# EAGLE design motobit (EAGLE 7.7.0)
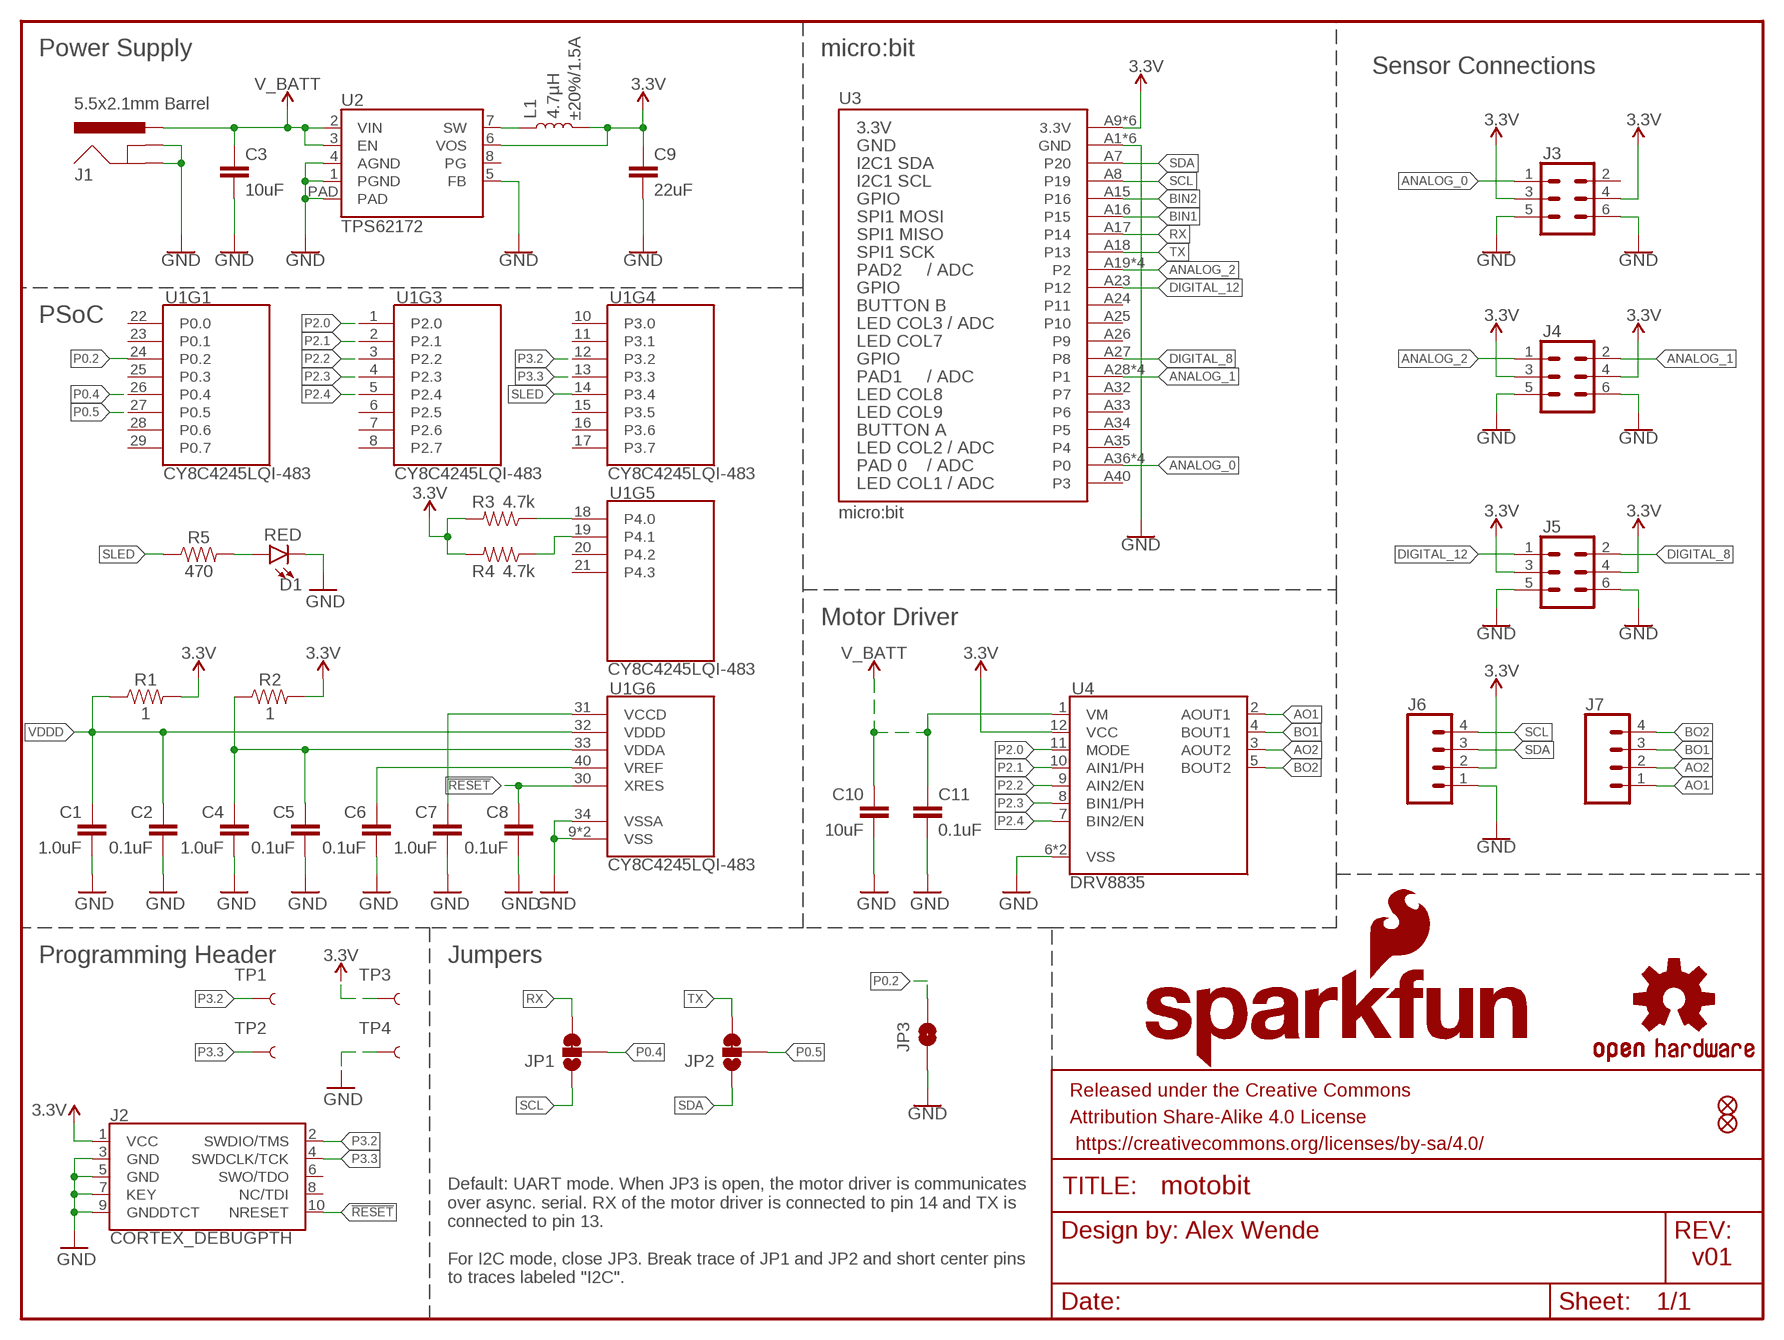
[diagram p0: schematic, sheet 1]

## Parts
C1  1.0uF  1.0UF-0603-16V-10%  [0603]
C2  0.1uF  0.1UF-0603-25V-(+80/-20%)  [0603]
C3  10uF  10UF-1210-50V-20%  [1210]
C4  1.0uF  1.0UF-0603-16V-10%  [0603]
C5  0.1uF  0.1UF-0603-25V-(+80/-20%)  [0603]
C6  0.1uF  0.1UF-0603-25V-(+80/-20%)  [0603]
C7  1.0uF  1.0UF-0603-16V-10%  [0603]
C8  0.1uF  0.1UF-0603-25V-(+80/-20%)  [0603]
C9  22uF  22UF-0805-6.3V-20%  [0805]
C10  10uF  10UF-1210-50V-20%  [1210]
C11  0.1uF  0.1UF-0603-25V-(+80/-20%)  [0603]
D1  RED  LED-RED0603  [LED-0603]
FD1  FIDUCIALUFIDUCIAL  [FIDUCIAL-MICRO]
FD2  FIDUCIALUFIDUCIAL  [FIDUCIAL-MICRO]
FRAME1  FRAME-LETTER  [CREATIVE_COMMONS]
J1  5.5x2.1mm Barrel  POWER_JACKSMD  [POWER_JACK_SMD]
J2  CORTEX_DEBUGPTH  [2X5-PTH-1.27MM]
J3  CONN_03X2FEMALE_SMD  [2X3_SMD]
J4  CONN_03X2FEMALE_SMD  [2X3_SMD]
J5  CONN_03X2FEMALE_SMD  [2X3_SMD]
J6  CONN_04SMD_STRAIGHT_COMBO  [1X04_SMD_VERTICAL_COMBO]
J7  CONN_04SMD_RA_FEMALE  [1X04_SMD_RA_FEMALE]
JP1  JUMPER-SMT_3_1-NC_TRACE_SILK  [SMT-JUMPER_3_1-NC_TRACE_SILK]
JP2  JUMPER-SMT_3_1-NC_TRACE_SILK  [SMT-JUMPER_3_1-NC_TRACE_SILK]
JP3  JUMPER-SMT_2_NO_SILK  [SMT-JUMPER_2_NO_SILK]
L1  4.7µH  INDUCTOR-VLF4012AT-2.2UH  [INDUCTOR_2.2UH]
LOGO1  SFE_LOGO_NAME_FLAME.2_INCH  [SFE_LOGO_NAME_FLAME_.2]
LOGO2  OSHW-LOGOM  [OSHW-LOGO-M]
R1  1  1OHM-0603-1/10W-1%  [0603]
R2  1  1OHM-0603-1/10W-1%  [0603]
R3  4.7k  4.7KOHM-0603-1/10W-1%  [0603]
R4  4.7k  4.7KOHM-0603-1/10W-1%  [0603]
R5  470  470OHM-0603-1/10W-1%  [0603]
TP1  TEST-POINT3  [PAD.03X.03]
TP2  TEST-POINT3  [PAD.03X.03]
TP3  TEST-POINT3  [PAD.03X.03]
TP4  TEST-POINT3  [PAD.03X.03]
U1  CY8C4245LQI-483  PSOC4_4200_40QFN  [QFN-40]
U2  TPS62172  [WSON-8-PAD]
U3  micro:bit  MICRO:BITLEDS_UP  [MICRO:BIT_RA_PTH]
U4  DRV8835  DRV883X  [WSON-12]

## Nets
3.3V: C9.1 J2.1(VCC) J3.3 J3.4 J4.3 J4.4 J5.3 J5.4 J6.2 L1.P$2 R1.2 R2.2 R3.2 R4.2 TP3.P$1 U2.6(VOS) U3.A9(3.3V) U3.A10(3.3V) U3.A11(3.3V) U3.A12(3.3V) U3.A13(3.3V) U3.A14(3.3V) U4.12(VCC)
!RESET: C8.1 J2.10(NRESET) U1.30(XRES)
ANALOG_0: J3.1 U3.A36(P0) U3.A37(P0) U3.A38(P0) U3.A39(P0)
ANALOG_1: J4.2 U3.A28(P1) U3.A29(P1) U3.A30(P1) U3.A31(P1)
ANALOG_2: J4.1 U3.A19(P2) U3.A20(P2) U3.A21(P2) U3.A22(P2)
AO1: J7.1 U4.2(AOUT1)
AO2: J7.2 U4.3(AOUT2)
BIN1: U3.A16(P15)
BIN2: U3.A15(P16)
BO1: J7.3 U4.4(BOUT1)
BO2: J7.4 U4.5(BOUT2)
DIGITAL_8: J5.2 U3.A27(P8)
DIGITAL_12: J5.1 U3.A23(P12)
GND: C1.2 C2.2 C3.2 C4.2 C5.2 C6.2 C7.2 C8.2 C9.2 C10.2 C11.2 D1.C J1.GND(GNDBREAK) J1.P$4(GND) J2.3(GND) J2.5(GND) J2.7(KEY) J2.9(GNDDTCT) J3.5 J3.6 J4.5 J4.6 J5.5 J5.6 J6.1 JP3.1 TP4.P$1 U1.9(VSS) U1.34(VSSA) U1.EP(VSS) U2.1(PGND) U2.4(AGND) U2.5(FB) U2.PAD U3.A1(GND) U3.A2(GND) U3.A3(GND) U3.A4(GND) U3.A5(GND) U3.A6(GND) U4.6(VSS) U4.PAD(VSS)
N$1: C7.1 U1.31(VCCD)
N$2: C6.1 U1.40(VREF)
N$3: C4.1 C5.1 R2.1 U1.33(VDDA)
N$4: L1.P$1 U2.7(SW)
N$6: R3.1 U1.18(P4.0)
N$7: R4.1 U1.19(P4.1)
N$8: D1.A R5.2
P0.2: JP3.2 U1.24(P0.2)
P0.4: JP1.2 U1.26(P0.4)
P0.5: JP2.2 U1.27(P0.5)
P2.0: U1.1(P2.0) U4.11(MODE)
P2.1: U1.2(P2.1) U4.10(AIN1/PH)
P2.2: U1.3(P2.2) U4.9(AIN2/EN)
P2.3: U1.4(P2.3) U4.8(BIN1/PH)
P2.4: U1.5(P2.4) U4.7(BIN2/EN)
P3.2: J2.2(SWDIO/TMS) TP1.P$1 U1.12(P3.2)
P3.3: J2.4(SWDCLK/TCK) TP2.P$1 U1.13(P3.3)
RX: JP1.3 U3.A17(P14)
SCL: J6.4 JP1.1 U3.A8(P19)
SDA: J6.3 JP2.1 U3.A7(P20)
SLED: R5.1 U1.14(P3.4)
TX: JP2.3 U3.A18(P13)
V_BATT: C3.1 C10.1 C11.1 J1.VIN0(PWR) U2.2(VIN) U2.3(EN) U4.1(VM)
VDDD: C1.1 C2.1 R1.1 U1.32(VDDD)
Unconnected: J2.6(SWO/TDO) J2.8(NC/TDI) J3.2 U1.6(P2.5) U1.7(P2.6) U1.8(P2.7) U1.10(P3.0) U1.11(P3.1) U1.15(P3.5) U1.16(P3.6) U1.17(P3.7) U1.20(P4.2) U1.21(P4.3) U1.22(P0.0) U1.23(P0.1) U1.25(P0.3) U1.28(P0.6) U1.29(P0.7) U1.35(P1.0) U1.36(P1.1) U1.37(P1.2) U1.38(P1.3) U1.39(P1.4) U2.8(PG) U3.A24(P11) U3.A25(P10) U3.A26(P9) U3.A32(P7) U3.A33(P6) U3.A34(P5) U3.A35(P4) U3.A40(P3)

## Notes on the sheet
- Power Supply | micro:bit
- Sensor Connections
- ±20%/1.5A
- PSoC
- Motor Driver
- Programming Header | Jumpers
- Alex Wende
- v01
- Default: UART mode. When JP3 is open, the motor driver is communicates
  over async. serial. RX of the motor driver is connected to pin 14 and TX is 
  connected to pin 13. 
  
  For I2C mode, close JP3. Break trace of JP1 and JP2 and short center pins
  to traces labeled "I2C".

## Library data of the parts
C1 C4 C7 = SparkFun-Capacitors:1.0UF: 1µF ceramic capacitors A capacitor is a passive two-terminal electrical component used to store electrical energy temporarily in an electric field.; PROD_ID: CAP-00868
C2 C5 C6 C8 C11 = SparkFun-Capacitors:0.1UF: 0.1µF ceramic capacitors A capacitor is a passive two-terminal electrical component used to store electrical energy temporarily in an electric field.; PROD_ID: CAP-00810
C3 C10 = SparkFun-Capacitors:10UF: 10.0µF ceramic capacitors A capacitor is a passive two-terminal electrical component used to store electrical energy temporarily in an electric field.; PROD_ID: CAP-09824
C9 = SparkFun-Capacitors:22UF: 22µF ceramic capacitors A capacitor is a passive two-terminal electrical component used to store electrical energy temporarily in an electric field.; PROD_ID: CAP-08402
D1 = SparkFun-LED:LED-RED: Red SMD LED Used in manufacturing of most products at SparkFun Packages: 0603 - SMD 0603 package [Product Link] <http://docs.avagotech.com/docs/AV02-0551EN> 0603 SMART - SMD 0603 SMART package ( more efficient and expensive)[Product Link] <http://www.osram-os.com/Graphics/XPic2/00077099_0.pdf> 1206 - SMD1206 package [Product Link] <https://www.sparkfun.com/datasheets/DevTools/LilyPad/Q150OVS4.pdff> SparkFun Products: Pro Mini 328 -5V <https://www.sparkfun.com/products/821> RedBoard <https://www.sparkfun.com/products/12757> IOIO-OTG <https://www.sparkfun.com/products/13613>; PROD_ID: DIO-00819
FD1 FD2 = SparkFun-Aesthetics:FIDUCIAL: Fiducial Alignment Points Point-of-reference for pick-and-place machines and other optical instruments.
FRAME1 = SparkFun-Aesthetics:FRAME-LETTER: Schematic Frame - Letter Standard 8.5x11 US Letter frame
J1 = SparkFun-Connectors:POWER_JACK: Power Jack Connector This is the standard 5.5mm barrel jack for power. The PTH is the most common, proven, reliable, footprint. The Slot footprint only works if the mill layer is transmitted to the PCB fab house so be warned. Here are the connectors we sell at SparkFun: DC Barrel Power Jack/Connector <https://www.sparkfun.com/products/119> (PRT-00119) DC Barrel Power Jack/Connector (SMD) <https://www.sparkfun.com/products/12748> (PRT-12748) DC Barrel Jack Adapter - Breadboard Compatible <https://www.sparkfun.com/products/10811> (PRT-10811) It is used on this SparkFun product (and many, many others): SparkFun RedBoard - Programmed with Arduino <https://www.sparkfun.com/products/12757> (DEV-12757) Also, if you need a mating power supply or connector, please check these out: Wall Adapter Power Supply - 9VDC 650mA <https://www.sparkfun.com/products/298> (TOL-00298) DC Barrel Jack Adapter - Male <https://www.sparkfun.com/products/10287> (PRT-10287); PROD_ID: CONN-08106; SF_ID: PRT-12748
J2 = Pete_Connectors_Retired:CORTEX_DEBUG: Cortex Debug Connector Datasheet <http://infocenter.arm.com/help/topic/com.arm.doc.faqs/attached/13634/cortex_debug_connectors.pdf>
J3-J5 = SparkFun-Connectors:CONN_03X2: Multi connection point. Often used as Generic Header-pin footprint for 0.1 inch spaced/style header connections You can populate with any combo of single row headers, but if you'd like an exact match, check these: Header - 2x3 (Male, 0.1") <https://www.sparkfun.com/products/12807> (PRT-12807) Header - 2x3 (Female, 0.1") <https://www.sparkfun.com/products/13010> (PRT-13010) 2x3 Pin Shrouded Header <https://www.sparkfun.com/products/10877> (PRT-10877) On any of the 0.1 inch spaced packages, you can populate with these: Break Away Headers - Straight <https://www.sparkfun.com/products/116> (PRT-00116) Break Away Male Headers - Right Angle <https://www.sparkfun.com/products/553> (PRT-00553) Female Headers <https://www.sparkfun.com/products/115> (PRT-00115) Break Away Headers - Machine Pin <https://www.sparkfun.com/products/117> (PRT-00117) Break Away Female Headers - Swiss Machine Pin <https://www.sparkfun.com/products/743> (PRT-00743) Special note: the shrouded connector mates well with our 3x2 ribbon cables: Ribbon Crimp Connector - 6-pin (2x3, Female) <https://www.sparkfun.com/products/10651> (PRT-10651) Ribbon Cable - 6 wire (15ft) <https://www.sparkfun.com/products/10646> (PRT-10646); PROD_ID: CONN-11290
J6 = SparkFun-Connectors:CONN_04: Multi connection point. Often used as Generic Header-pin footprint for 0.1 inch spaced/style header connections On any of the 0.1 inch spaced packages, you can populate with these: Break Away Headers - Straight <https://www.sparkfun.com/products/116> (PRT-00116) Break Away Male Headers - Right Angle <https://www.sparkfun.com/products/553> (PRT-00553) Female Headers <https://www.sparkfun.com/products/115> (PRT-00115) Break Away Headers - Machine Pin <https://www.sparkfun.com/products/117> (PRT-00117) Break Away Female Headers - Swiss Machine Pin <https://www.sparkfun.com/products/743> (PRT-00743) For SCREWTERMINALS and SPRING TERMINALS visit here: Screw Terimnals on SparkFun.com <https://www.sparkfun.com/search/results?term=Screw+Terminals> (5mm/3.5mm/2.54mm spacing) This device is also useful as a general connection point to wire up your design to another part of your project. Our various solder wires solder well into these plated through hole pads. Hook-Up Wire - Assortment (Stranded, 22 AWG) <https://www.sparkfun.com/products/11375> (PRT-11375) Hook-Up Wire - Assortment (Solid Core, 22 AWG) <https://www.sparkfun.com/products/11367> (PRT-11367) View the entire wire category on our website here <https://www.sparkfun.com/categories/141> Special notes: Molex polarized connector foot print use with SKU : PRT-08231 with associated crimp pins and housings. 1MM SMD Version SKU: PRT-10208; PROD_ID: CONN-08511; VALUE: 1X04_SMD_STRAIGHT_COMBO
J7 = SparkFun-Connectors:CONN_04: Multi connection point. Often used as Generic Header-pin footprint for 0.1 inch spaced/style header connections On any of the 0.1 inch spaced packages, you can populate with these: Break Away Headers - Straight <https://www.sparkfun.com/products/116> (PRT-00116) Break Away Male Headers - Right Angle <https://www.sparkfun.com/products/553> (PRT-00553) Female Headers <https://www.sparkfun.com/products/115> (PRT-00115) Break Away Headers - Machine Pin <https://www.sparkfun.com/products/117> (PRT-00117) Break Away Female Headers - Swiss Machine Pin <https://www.sparkfun.com/products/743> (PRT-00743) For SCREWTERMINALS and SPRING TERMINALS visit here: Screw Terimnals on SparkFun.com <https://www.sparkfun.com/search/results?term=Screw+Terminals> (5mm/3.5mm/2.54mm spacing) This device is also useful as a general connection point to wire up your design to another part of your project. Our various solder wires solder well into these plated through hole pads. Hook-Up Wire - Assortment (Stranded, 22 AWG) <https://www.sparkfun.com/products/11375> (PRT-11375) Hook-Up Wire - Assortment (Solid Core, 22 AWG) <https://www.sparkfun.com/products/11367> (PRT-11367) View the entire wire category on our website here <https://www.sparkfun.com/categories/141> Special notes: Molex polarized connector foot print use with SKU : PRT-08231 with associated crimp pins and housings. 1MM SMD Version SKU: PRT-10208
JP1 JP2 = SparkFun-Jumpers:JUMPER-SMT_3_1-NC_TRACE: Normally closed trace jumper (1 of 2 connections) This jumper has a trace between two pads so it's normally closed (NC). The other connection is normally open (NO). Use a razor knife to open the connection. For best results follow the IPC guidelines for cutting traces: Cutout at least 0.063 mm (0.005 in). Remove all loose material to clean up the cut area. Seal the cut with an approved epoxy. Reapply solder to reclose the connection, or to close the NO connection.
JP3 = SparkFun-Jumpers:JUMPER-SMT_2_NO: Normally open jumper This jumper has two pads in close proximity to each other. Apply solder to close the connection. Round pads are easier to solder for beginners, but are a lot larger. SparkFun Product that uses the round pads: SparkFun EL Sequencer <https://www.sparkfun.com/products/12781>
L1 = SparkFun-Coils:INDUCTOR: Inductors Resist changes in electrical current. Basically a coil of wire. SparkFun Products: SparkFun Load Cell Amplifier - HX711 <https://www.sparkfun.com/products/13879> IOIO-OTG - V2.2 <https://www.sparkfun.com/products/13613>; PROD_ID: NDUC-09513; VALUE: 4.7µH/±20%/1.5A
LOGO1 = SparkFun-Aesthetics:SFE_LOGO_NAME_FLAME: SparkFun Font Logo w/ Flame This is the SparkFun full logo. The logo on the schematic will always be the same size; the package variant is the height of the flame part of the logo. Default layer for the logo on the board is tSilk.
LOGO2 = SparkFun-Aesthetics:OSHW-LOGO: Open-Source Hardware (OSHW) Logo This logo indicates the piece of hardware it is found on incorporates a OSHW license and/or adheres to the definition of open source hardware found here: http://freedomdefined.org/OSHW
R1 R2 = SparkFun-Resistors:1OHM: 1Ω resistor A resistor is a passive two-terminal electrical component that implements electrical resistance as a circuit element. Resistors act to reduce current flow, and, at the same time, act to lower voltage levels within circuits. - Wikipedia; PROD_ID: RES-08269
R3 R4 = SparkFun-Resistors:4.7KOHM: 4.7kΩ resistor A resistor is a passive two-terminal electrical component that implements electrical resistance as a circuit element. Resistors act to reduce current flow, and, at the same time, act to lower voltage levels within circuits. - Wikipedia; PROD_ID: RES-07857
R5 = SparkFun-Resistors:470OHM: 470Ω resistor A resistor is a passive two-terminal electrical component that implements electrical resistance as a circuit element. Resistors act to reduce current flow, and, at the same time, act to lower voltage levels within circuits. - Wikipedia; PROD_ID: RES-07869
TP1-TP4 = SparkFun-Connectors:TEST-POINT: SparkFun Test Points Bare copper test points for troubleshooting or In-Circuit-Testing. These are used by our Production team for verifying production board runs using pogo-pins on test beds. SparkFun Products: SparkFun LSM9DS1 Breakout <https://www.sparkfun.com/products/13284> SparkFun PSOC <https://www.sparkfun.com/products/13714> SparkFun Load Cell Amplifier <https://www.sparkfun.com/products/13879>
U1 = SparkFun-IC-Microcontroller:PSOC4_4200_40QFN: Cypress PSoC 4200 32-bit MCU 48-MHz ARM Cortex-M0 Datasheet <http://www.cypress.com/file/138656/download> SparkFun Products: SparkFun serial Controlled Motor Driver <https://www.sparkfun.com/products/13911>; PROD_ID: IC-13292
U2 = SparkFun-IC-Power:TPS62172: Texas Instruments TPS62172 3-17V 0.5A Step-Down Converter with DCS control. Available in adjustable and fixed output voltage versions. Is packaged in an 8-pin WSON package measuring 2 × 2 mm (DSG). See a 3.3V fixed output version of this chip in action on the Electric Imp Breakout Board <https://www.sparkfun.com/products/11400>. Datasheet <http://www.ti.com/lit/gpn/tps62172>; PROD_ID: IC-11307
U3 = Micro_Bit_Parts:MICRO:BIT: BBC MICRO_BIT with 5x5 LED array facing the direction noted in the variant. "UP" means away from the host board, "Down" means facing towards the host board.; PROD_ID: CONN-13452
U4 = SparkFun-IC-Special-Function:DRV883X: DRV8835 2 Channel Motor Driver Dual 1.5A H-bridge, 2-11V Datasheet <http://www.ti.com/lit/ds/symlink/drv8835.pdf> SparkFun Products: SparkFun Serial Controlled Motor Driver <https://www.sparkfun.com/products/13911>; PROD_ID: IC-13342

## Board
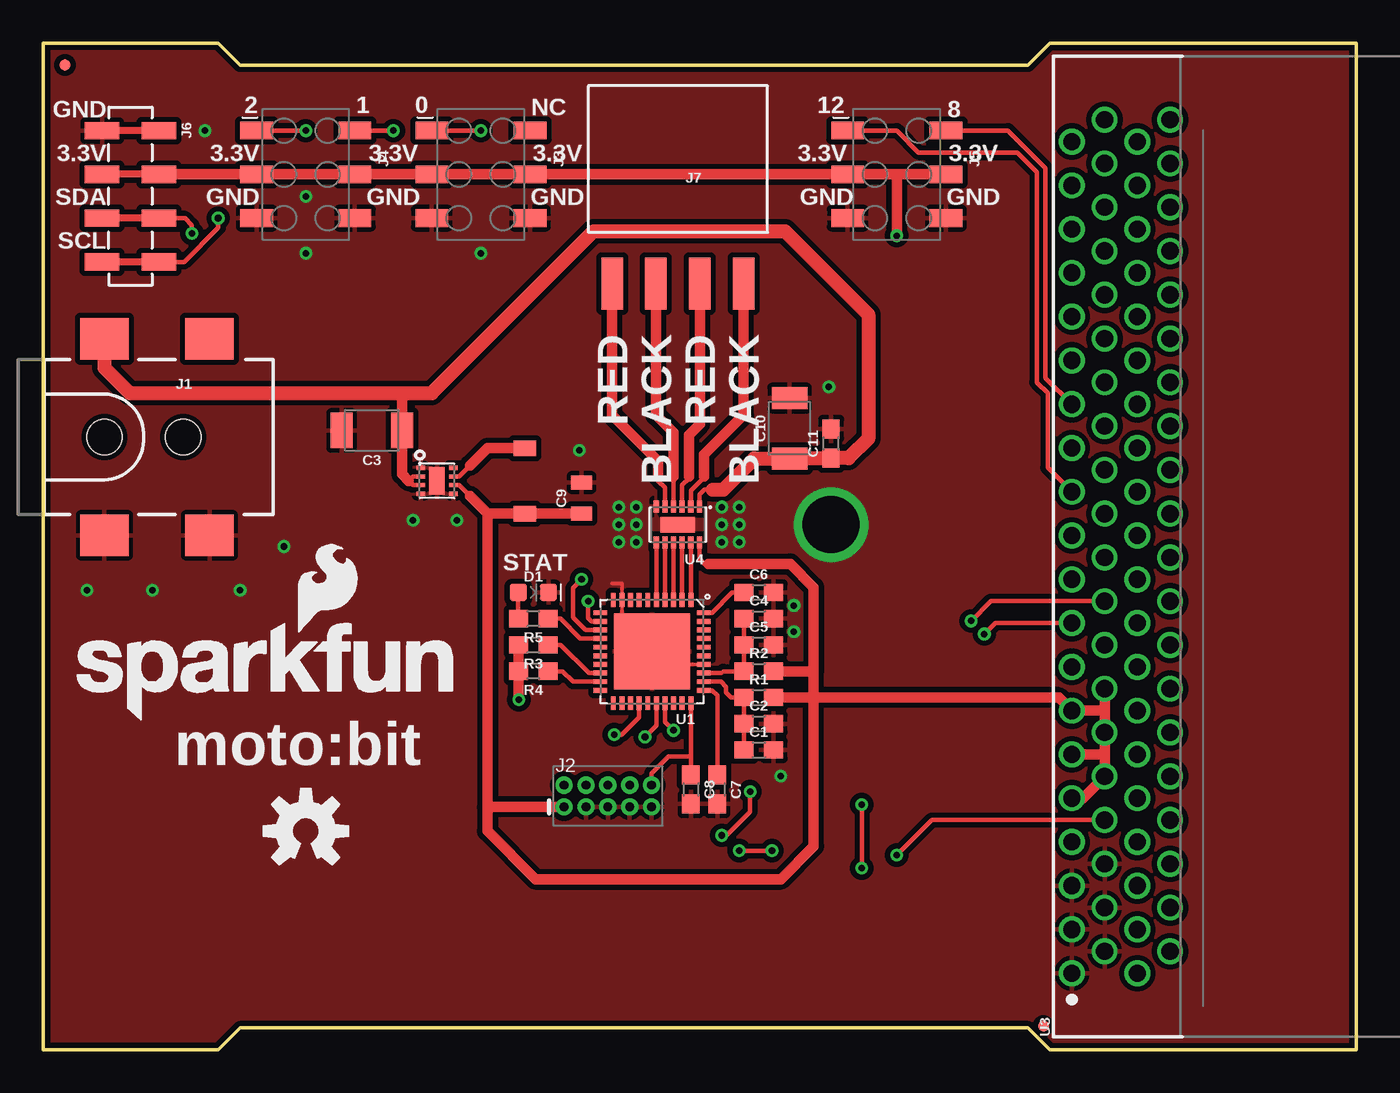
[diagram p1: board, top side]
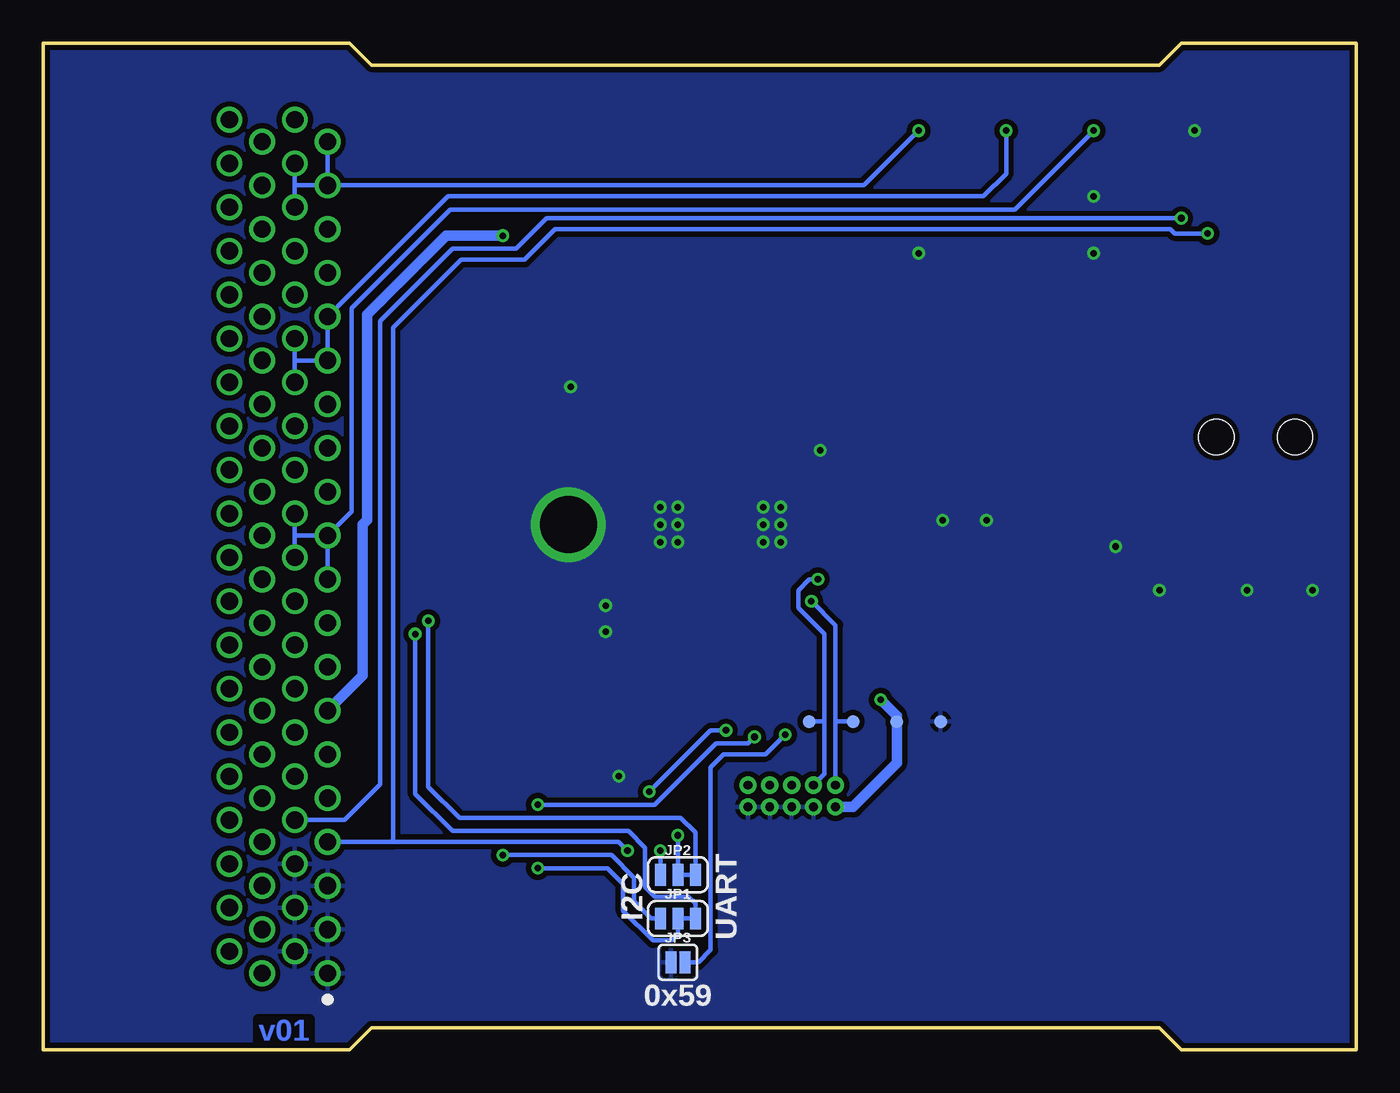
[diagram p2: board, bottom side, seen from below]

Size 76.2 x 58.42 mm. Coordinates in mm from the lower left corner, seen from the top.
Outline: 57.15,1.27 11.43,1.27 10.16,0 0,0 0,58.42 10.16,58.42 11.43,57.15 57.15,57.15 58.42,58.42 76.2,58.42 76.2,0 58.42,0 57.15,1.27
Copper layers (1*16): Top 0.035mm / dielectric 1.5mm / Bottom 0.035mm
Design rules "SparkFun-2-layer-TIGHT": minimum track width 7mil, minimum drill 15mil, track to track 7mil, track to pad 7mil, pad to pad 7mil, via to via 7mil, smd to smd 7mil, copper to edge 7mil, drill to drill 7mil, minimum pad ring 7mil, minimum via ring 7mil, stop-mask expansion 4mil, vias tented up to drill 25mil, thermal gap 10mil

### Footprints (pad centres in the part's own frame; a part is rotated, then mirrored left to right if it is on the bottom)
0603 = smd 1.1 x 1: 1 -0.85,0; 2 0.85,0
1210 = smd 1.27 x 2.06: 1 -1.755,0; 2 1.755,0
0805 = smd 0.8 x 1.2: 1 -0.9,0; 2 0.9,0
LED-0603 = smd 1 x 1: A -0.877,0; C 0.877,0
FIDUCIAL-MICRO = smd 0.635 x 0.635: 1 0,0
POWER_JACK_SMD = smd 2.8 x 2.4: GND 0,-5.7; P$4 6.1,-5.7; VIN0 0,5.7; VIN1 6.1,5.7 | hole 2.032: 0,0; 4.572,0
2X5-PTH-1.27MM = drill 0.508 pad 1: 1 -2.54,-0.635; 2 -2.54,0.635; 3 -1.27,-0.635; 4 -1.27,0.635; 5 0,-0.635; 6 0,0.635; 7 1.27,-0.635; 8 1.27,0.635; 9 2.54,-0.635; 10 2.54,0.635
2X3_SMD = smd 1.02 x 1.9: 1 -2.54,-2.85; 2 -2.54,2.85; 3 0,-2.85; 4 0,2.85; 5 2.54,-2.85; 6 2.54,2.85
1X04_SMD_VERTICAL_COMBO = smd 1 x 2: 1 0,-1.65; 1-2 0,1.65; 2 2.54,1.65; 2-2 2.54,-1.65; 3 5.08,-1.65; 3-2 5.08,1.65; 4 7.62,1.65; 4-2 7.62,-1.65
1X04_SMD_RA_FEMALE = smd 1.25 x 3: 1 -3.81,7.225; 2 -1.27,7.225; 3 1.27,7.225; 4 3.81,7.225
SMT-JUMPER_3_1-NC_TRACE_SILK = smd 0.635 x 1.27: 1 -1.016,0; 2 0,0; 3 1.016,0
SMT-JUMPER_2_NO_SILK = smd 0.635 x 1.27: 1 -0.406,0; 2 0.406,0
INDUCTOR_2.2UH = smd 0.9 x 1.3: P$1 -1.9,0; P$2 1.9,0
PAD.03X.03 = smd 0.762 x 0.762: P$1 0,0
QFN-40 = smd 0.285 x 0.8: 1 -2.25,-3; 2 -1.75,-3; 3 -1.25,-3; 4 -0.75,-3; 5 -0.25,-3; 6 0.25,-3; 7 0.75,-3; 8 1.25,-3; 9 1.75,-3; 10 2.25,-3; 21 2.25,3; 22 1.75,3; 23 1.25,3; 24 0.75,3; 25 0.25,3; 26 -0.25,3; 27 -0.75,3; 28 -1.25,3; 29 -1.75,3; 30 -2.25,3 | smd 0.8 x 0.285: 11 3,-2.25; 12 3,-1.75; 13 3,-1.25; 14 3,-0.75; 15 3,-0.25; 16 3,0.25; 17 3,0.75; 18 3,1.25; 19 3,1.75; 20 3,2.25; 31 -3,2.25; 32 -3,1.75; 33 -3,1.25; 34 -3,0.75; 35 -3,0.25; 36 -3,-0.25; 37 -3,-0.75; 38 -3,-1.25; 39 -3,-1.75; 40 -3,-2.25 | smd 4.4 x 4.4: EP 0,0
WSON-8-PAD = smd 0.25 x 0.5: 1 -0.75,-0.95; 2 -0.25,-0.95; 3 0.25,-0.95; 4 0.75,-0.95; 5 0.75,0.95; 6 0.25,0.95; 7 -0.25,0.95; 8 -0.75,0.95 | smd 1.6 x 0.9: PAD 0,0
MICRO:BIT_RA_PTH = drill 1: A1 -24.765,7.62; A2 -23.495,5.72; A3 -22.225,7.62; A4 -20.955,5.72; A5 -19.685,7.62; A6 -18.415,5.72; A7 -17.145,7.62; A8 -15.875,5.72; A9 -14.605,7.62; A10 -13.335,5.72; A11 -12.065,7.62; A12 -10.795,5.72; A13 -9.525,7.62; A14 -8.255,5.72; A15 -6.985,7.62; A16 -5.715,5.72; A17 -4.445,7.62; A18 -3.175,5.72; A19 -1.905,7.62; A20 -0.635,5.72; A21 0.635,7.62; A22 1.905,5.72; A23 3.175,7.62; A24 4.445,5.72; A25 5.715,7.62; A26 6.985,5.72; A27 8.255,7.62; A28 9.525,5.72; A29 10.795,7.62; A30 12.065,5.72; A31 13.335,7.62; A32 14.605,5.72; A33 15.875,7.62; A34 17.145,5.72; A35 18.415,7.62; A36 19.685,5.72; A37 20.955,7.62; A38 22.225,5.72; A39 23.495,7.62; A40 24.765,5.72; B1 -24.765,3.82; B2 -23.495,1.92; B3 -22.225,3.82; B4 -20.955,1.92; B5 -19.685,3.82; B6 -18.415,1.92; B7 -17.145,3.82; B8 -15.875,1.92; B9 -14.605,3.82; B10 -13.335,1.92; B11 -12.065,3.82; B12 -10.795,1.92; B13 -9.525,3.82; B14 -8.255,1.92; B15 -6.985,3.82; B16 -5.715,1.92; B17 -4.445,3.82; B18 -3.175,1.92; B19 -1.905,3.82; B20 -0.635,1.92; B21 0.635,3.82; B22 1.905,1.92; B23 3.175,3.82; B24 4.445,1.92; B25 5.715,3.82; B26 6.985,1.92; B27 8.255,3.82; B28 9.525,1.92; B29 10.795,3.82; B30 12.065,1.92; B31 13.335,3.82; B32 14.605,1.92; B33 15.875,3.82; B34 17.145,1.92; B35 18.415,3.82; B36 19.685,1.92; B37 20.955,3.82; B38 22.225,1.92; B39 23.495,3.82; B40 24.765,1.92
WSON-12 = smd 0.3 x 0.7: 1 -1.25,-1.05; 2 -0.75,-1.05; 3 -0.25,-1.05; 4 0.25,-1.05; 5 0.75,-1.05; 6 1.25,-1.05; 7 1.25,1.05; 8 0.75,1.05; 9 0.25,1.05; 10 -0.25,1.05; 11 -0.75,1.05; 12 -1.25,1.05 | smd 2 x 0.9: PAD 0,0

### Placement (x,y rotation side)
C1  41.53,17.4 0 top
C2  41.53,18.92 0 top
C3  19.08,35.94 180 top
C4  41.53,25.02 0 top
C5  41.53,23.5 0 top
C6  41.53,26.54 0 top
C7  39.12,15.11 270 top
C8  37.58,15.11 270 top
C9  31.24,32.02 90 top
C10  43.31,36.07 90 top
C11  45.72,35.18 90 top
D1  28.45,26.54 0 top
FD1  58.04,1.4 0 top
FD2  1.27,57.15 0 top
FRAME1  5.08,-27.94 0 top  (outside the outline)
J1  3.56,35.56 0 top
J2  32.77,14.73 0 top
J3  25.4,50.8 270 top
J4  15.24,50.8 270 top
J5  49.53,50.8 270 top
J6  5.08,53.34 270 top
J7  36.83,51.69 180 top
JP1  39.37,7.62 0 bottom
JP2  39.37,10.16 0 bottom
JP3  39.37,5.08 0 bottom
L1  27.94,33.02 270 top
LOGO1  1.27,19.05 0 top
LOGO2  15.24,12.7 0 top
R1  41.53,20.45 0 top
R2  41.53,21.97 0 top
R3  28.45,23.5 180 top
R4  28.45,21.97 180 top
R5  28.45,25.02 180 top
TP1  29.21,19.05 0 bottom
TP2  31.75,19.05 0 bottom
TP3  26.67,19.05 0 bottom
TP4  24.13,19.05 0 bottom
U1  35.33,23.11 180 top
U2  22.86,33.02 270 top
U3  67.31,29.21 90 top
U4  36.83,30.48 180 top
U$1  [PRODUCTION_INSTRUCTIONS]  -7.62,-33.02 0 top  (outside the outline)

### Tracks (layer width: path | path; a pad name or v marks a point on that pad's centre or on a via)
3.3V  (via drill 0.38)
  Top 0.254: 38.61,28.19 38.37,28.19 38.08,28.49 U4.12 | 24.77,32.13 24.13,32.77 U2.6
  Top 0.61: v49.53,47.24 49.53,50.8 | J6.2 J4.3 J4.4 J3.3 J3.4 J5.3 49.53,50.8 | 49.53,50.8 J5.4 | 25.78,31.12 L1.P$2 C9.1 | 25.78,31.12 24.77,32.13 | 61.59,19.68 U3.A12 61.59,17.14 | 61.59,17.14 U3.A10 60.32,14.61 U3.A9 | U3.A11 61.59,17.14 | 61.59,19.68 U3.A13 58.93,20.45 44.7,20.45 | 61.59,19.68 U3.A14 | 38.61,28.19 43.35,28.19 44.7,26.84 44.7,21.97 | 44.7,20.45 R1.2 | R2.2 44.7,21.97 | 44.7,20.45 44.7,21.97 | 44.7,20.45 44.7,11.81 42.8,9.91 28.57,9.91 25.78,12.7 25.78,14.1 | 25.78,31.12 25.78,14.1 | J2.1 25.78,14.1 | v27.6,20.32 R4.2 R3.2
  Bottom 0.254: U3.A9 60.32,14.61
  Bottom 0.61: U3.A13 57.66,21.72 57.66,30.48 57.4,30.73 57.4,42.67 52.83,47.24 v49.53,47.24 | J2.1 29.21,14.1 26.67,16.64 TP3.P$1 26.67,19.39 v27.6,20.32
!RESET
  Top 0.254: J2.10 35.31,16.05 36.27,17.02 37.58,17.02 | U1.30 37.58,17.02 | C8.1 37.58,17.02
ANALOG_0  (via drill 0.38)
  Top 0.254: v25.4,53.34 J3.1
  Bottom 0.254: 61.59,50.16 U3.A38 | U3.A39 U3.A37 | U3.A37 61.59,50.16 | 61.59,50.16 U3.A36 | U3.A37 28.57,50.16 v25.4,53.34
ANALOG_1  (via drill 0.38)
  Top 0.254: J4.2 v20.32,53.34
  Bottom 0.254: U3.A28 61.59,40.01 | 61.59,40.01 U3.A29 U3.A31 52.7,49.53 21.65,49.53 20.32,50.86 v20.32,53.34 | 61.59,40.01 U3.A30
ANALOG_2  (via drill 0.38)
  Top 0.254: v15.24,53.34 J4.1
  Bottom 0.254: U3.A20 U3.A22 61.59,29.84 U3.A21 | U3.A19 U3.A21 | v15.24,53.34 19.81,48.77 52.58,48.77 58.29,43.05 58.29,31.24 U3.A21
AO1
  Top 0.254: U4.2 37.58,32.45 38.35,33.22 38.35,33.27
  Top 0.61: J7.1 40.64,36.83 38.35,34.54 38.35,33.27
AO2
  Top 0.254: U4.3 37.08,32.76 37.47,33.15 37.47,33.27
  Top 0.61: J7.2 38.1,36.32 37.47,35.69 37.47,33.27
BO1
  Top 0.254: U4.4 36.58,33.27
  Top 0.61: J7.3 35.56,36.83 36.58,35.81 36.58,33.27
BO2
  Top 0.254: U4.5 36.08,32.63 35.69,33.02 35.69,33.27
  Top 0.61: J7.4 33.02,36.83 35.69,34.16 35.69,33.27
DIGITAL_8
  Top 0.254: J5.2 55.98,53.34 58.17,51.16 58.17,38.99 U3.A27
DIGITAL_12
  Top 0.254: J5.1 49.53,53.34 50.8,52.07 56.52,52.07 57.66,50.93 57.66,38.73 58.29,38.1 58.29,33.78 U3.A23
GND  (via drill 0.38, 3.3)
  Top 0.203: U1.34 35.33,22.36 U1.EP 33.58,23.11 U1.9 33.58,27.05 33.02,27.05
  other vias: 39.37,30.48 39.37,31.5 39.37,29.46 40.39,31.5 40.39,30.48 40.39,29.46 33.4,30.48 33.4,31.5 33.4,29.46 34.42,31.5 34.42,30.48 34.42,29.46 31.11,34.8 21.46,30.73 24,30.73 13.97,29.21 11.43,26.67 6.35,26.67 2.54,26.67 9.4,53.34 15.24,49.53 15.24,46.23 25.4,46.23 43.56,25.78 43.56,24.26 42.8,15.88 45.59,38.48 45.72,30.48
  pour Bottom (isolate 0.305): 0,58.42 10.16,58.42 11.43,57.15 57.15,57.15 58.42,58.42 76.2,58.42 76.2,0 58.42,0 57.15,1.27 11.43,1.27 10.16,0 0,0
  pour Top (isolate 0.305): 0,58.42 10.16,58.42 11.43,57.15 57.15,57.15 58.42,58.42 76.2,58.42 76.2,0 58.42,0 57.15,1.27 11.43,1.27 10.16,0 0,0
N$1
  Top 0.254: U1.31 38.81,20.86 39.12,20.56 C7.1
N$2
  Top 0.254: U1.40 38.8,25.36 39.98,26.54 C6.1
N$3
  Top 0.254: C4.1 C5.1 R2.1 39.48,21.97 39.37,21.86 U1.33
N$4
  Top 0.254: U2.7 24.13,33.27 24.77,33.91
  Top 0.61: 24.77,33.91 25.78,34.92 L1.P$1
N$6
  Top 0.254: R3.1 30.03,23.5 31.66,21.86 U1.18
N$7
  Top 0.254: R4.1 30.13,21.97 30.73,21.36 U1.19
N$8
  Top 0.254: D1.A 27.57,25.02 R5.2
P0.2  (via drill 0.38)
  Top 0.254: v33.15,18.29 33.56,18.29 34.58,19.3 U1.24
  Bottom 0.254: JP3.2 38.18,5.08 37.47,5.8 37.47,16.4 36.72,17.14 34.29,17.14 v33.15,18.29
P0.4  (via drill 0.38)
  Top 0.254: U1.26 35.58,18.82 v34.92,18.16 | v47.5,14.22 v47.5,10.54
  Bottom 0.254: JP1.2 39.37,6.71 39.73,6.35 40.82,6.35 42.55,8.08 42.55,9.64 43.44,10.54 v47.5,10.54 | v47.5,14.22 40.72,14.22 37.16,17.78 35.31,17.78 v34.92,18.16
P0.5  (via drill 0.38)
  Top 0.254: U1.27 36.08,19.04 v36.58,18.54 | v41.02,14.99 41.02,13.82 39.65,12.45 v39.37,12.45
  Bottom 0.254: v39.37,12.45 JP2.2 | v36.58,18.54 37.47,18.54 v41.02,14.99
P2.0
  Top 0.254: U4.11 U1.1
P2.1
  Top 0.254: U4.10 U1.2
P2.2
  Top 0.254: U4.9 U1.3
P2.3
  Top 0.254: U4.8 U1.4
P2.4
  Top 0.254: U4.7 U1.5
P3.2  (via drill 0.38)
  Top 0.254: U1.12 31.82,24.86 31.62,25.06 v31.62,26.04
  Bottom 0.254: J2.2 30.23,19.05 | 30.23,19.05 30.23,24.64 v31.62,26.04 | TP1.P$1 30.23,19.05
P3.3  (via drill 0.38)
  Top 0.254: U1.13 31.47,24.36 30.73,25.1 30.73,26.8 v31.24,27.3
  Bottom 0.254: TP2.P$1 30.86,19.05 | 30.86,19.05 30.86,24.13 32.38,25.65 32.38,26.67 31.75,27.3 v31.24,27.3 | J2.4 30.86,16 30.86,19.05
RX  (via drill 0.38)
  Top 0.254: U3.A17 55.24,24.77 v54.61,24.13
  Bottom 0.254: v54.61,24.13 54.61,14.86 52.45,12.7 42.24,12.7 41.27,11.73 41.27,9.46 40.71,8.89 38.76,8.89 38.35,8.49 JP1.3
SCL  (via drill 0.38)
  Top 0.254: v10.16,48.26 10.16,47.7 8.18,45.72 J6.4 | v49.53,11.3 51.56,13.34 U3.A8
  Bottom 0.254: U3.A8 58.71,13.34 56.64,15.4 56.64,42.29 52.45,46.48 48.77,46.48 46.99,48.26 v10.16,48.26 | v49.53,11.3 43.22,11.3 41.91,9.99 41.91,8.61 40.92,7.62 JP1.1
SDA  (via drill 0.38)
  Top 0.254: v8.64,47.37 8.64,47.86 8.23,48.26 J6.3 | v40.39,11.56 v42.29,11.56
  Bottom 0.254: U3.A7 55.88,12.06 | 55.88,12.06 55.88,41.91 51.94,45.85 48.26,45.85 46.48,47.62 10.79,47.62 10.54,47.37 v8.64,47.37 | JP2.1 v40.39,11.56 | v42.29,11.56 42.8,12.06 55.88,12.06
SLED
  Top 0.254: R5.1 30.01,25.02 31.17,23.86 U1.14
TX  (via drill 0.38)
  Top 0.254: v53.85,24.89 54.99,26.04 U3.A18
  Bottom 0.254: v53.85,24.89 53.85,15.27 52.04,13.46 39.21,13.46 38.35,12.61 JP2.3
V_BATT
  Top 0.254: 38.86,32.51 38.37,32.51 38.08,32.22 U4.1 | U2.2 21.46,33.27 21.21,33.02 21.46,32.77 U2.3
  Top 0.61: 21.21,33.02 20.83,33.4 C3.1 20.83,38.1 | C10.1 43.32,34.33 | 20.83,38.1 20.32,38.1 | 20.83,38.1 21.59,38.1
  Top 0.813: J1.VIN0 3.56,39.58 5.04,38.1 20.32,38.1 21.59,38.1 22.55,38.1 31.95,47.5 43.05,47.5 47.88,42.67 47.88,35.47 46.74,34.33 C11.1 43.32,34.33 | 38.86,32.51 39.47,32.51 41.27,34.31 C10.1
VDDD
  Top 0.254: C1.1 C2.1 R1.1 39.91,20.45 39.62,20.73 39.62,21.07 39.33,21.36 U1.32

### Text on the board
Bottom: v01
tPlace: GND | 2 | 1 | 0 | NC | 12 | 8 | 3.3V | 3.3V | 3.3V | 3.3V | 3.3V | 3.3V | SDA | GND | GND | GND | GND | GND | SCL | RED | BLACK | RED | BLACK | STAT | moto:bit
bPlace: UART | I2C | 0x59
Measures: Units are in inches
tDocu: Alex Wende | - Solder mask color : Black